# Altium schematic sheet 09) Expansion & Connect.SchDoc
size B; CompanyName: Microchip Technology Inc.; Organization: Microchip Technology; Address1: 2355 West Chandler Blvd.; Address2: Chandler, AZ  85224; Address4: USA; DocumentNumber: 9; SheetNumber: 9; SheetTotal: 9; SheetTitle: **; Time: Time
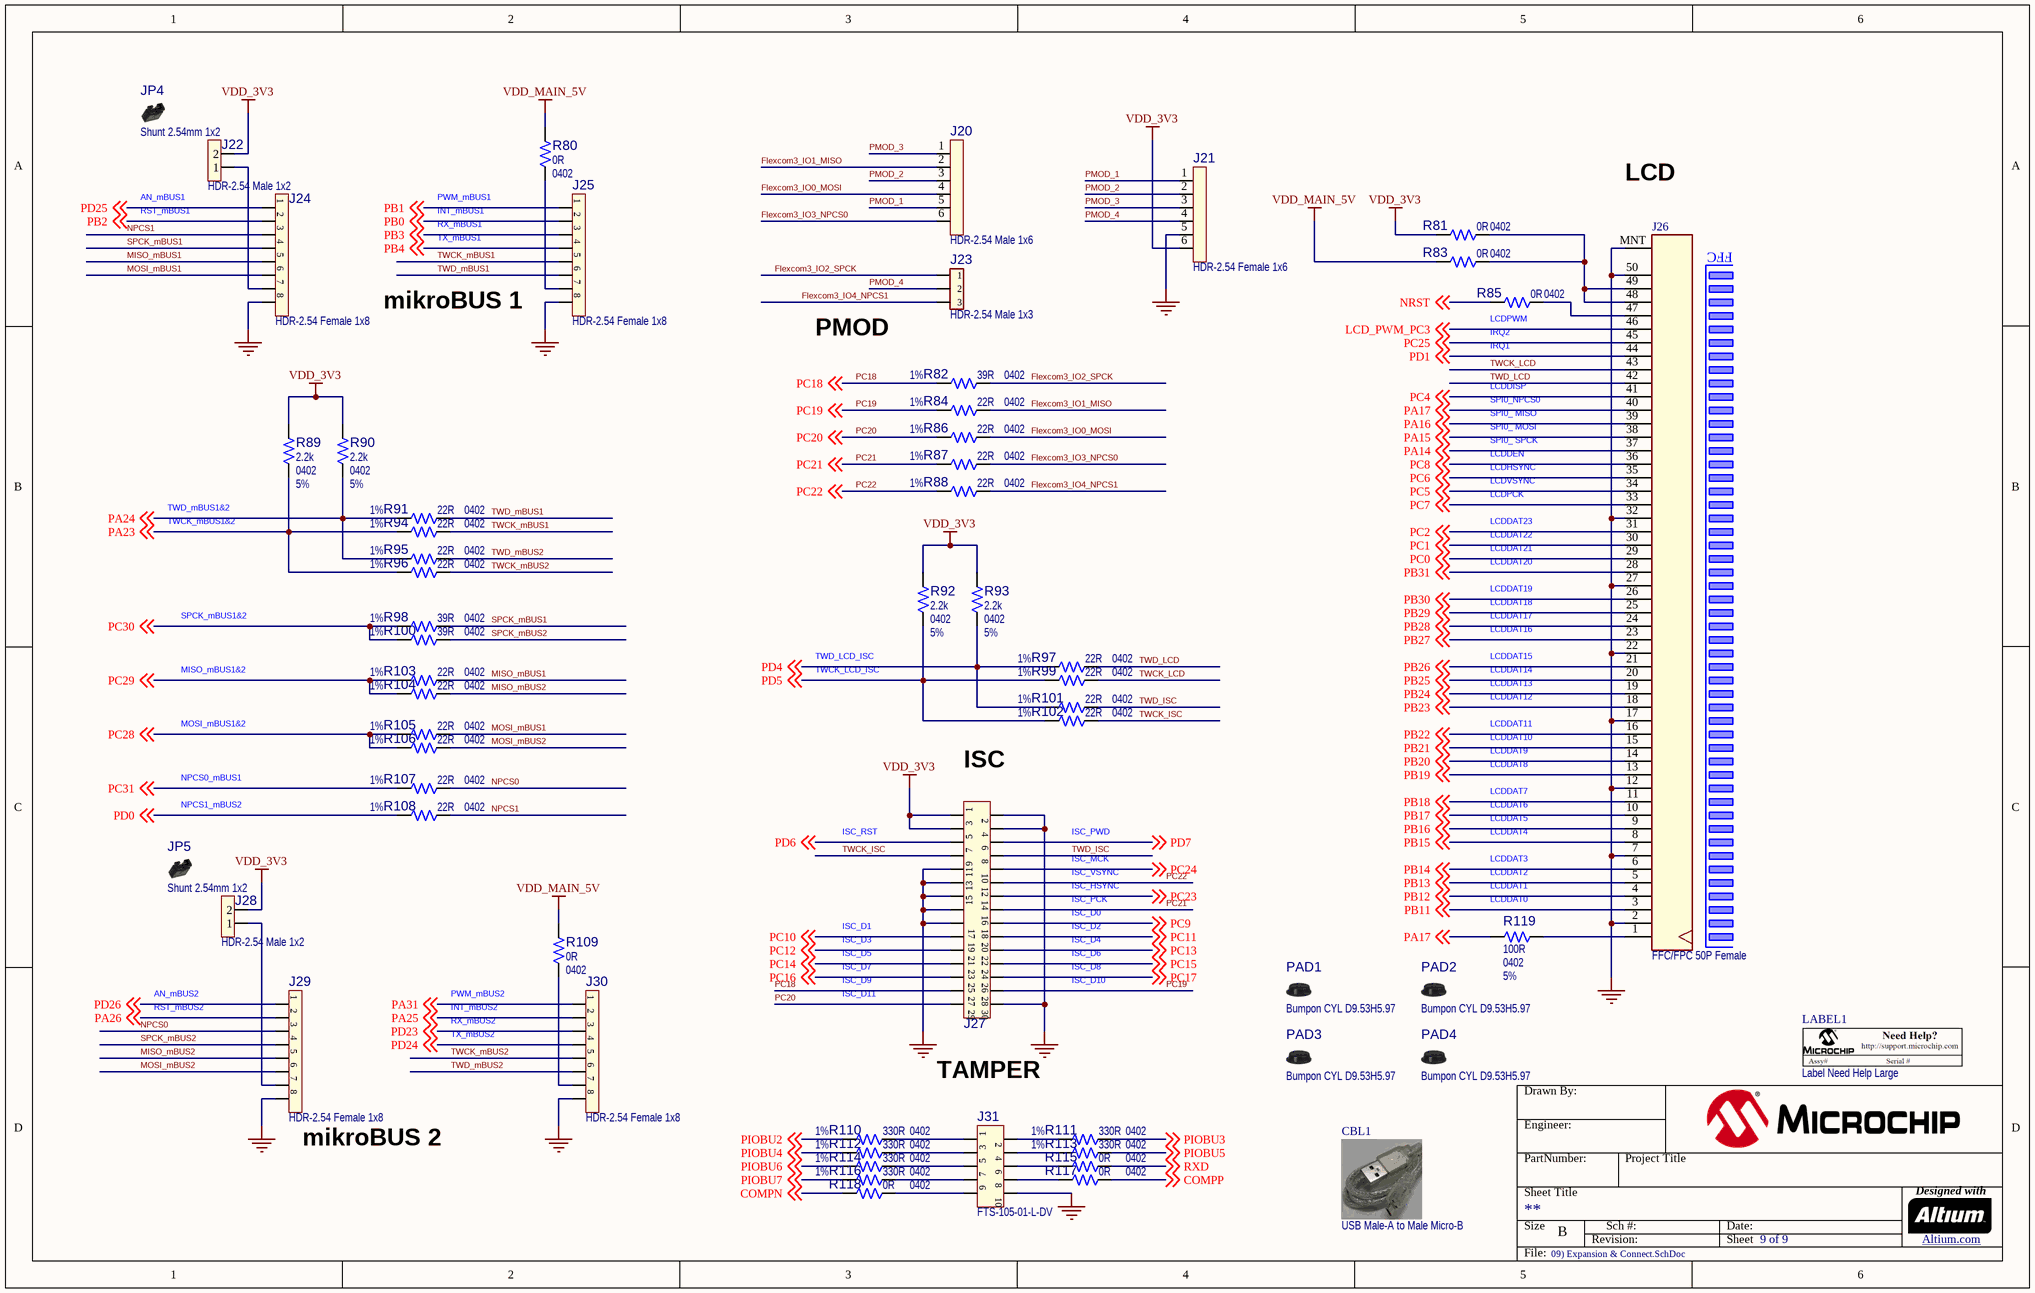
[diagram p0: 09) Expansion & Connect.SchDoc]

## Parts
?  (no value)  (graphical)
CBL1  value USB Male-A to Male Micro-B  (hidden comment: Cable USB A to Micro-B)  (mechanical)
J20  value HDR-2.54 Male 1x6  [HDR_M_2.54_1x6]  (hidden comment: Header 1x6)
J21  value HDR-2.54 Female 1x6  [HDR_F_2.54_1x6_RA]  (hidden comment: Header 1x6)
J22  value HDR-2.54 Male 1x2  [HDR_M_2.54_1x2]  (hidden comment: Header 1x2)
J23  value HDR-2.54 Male 1x3  [HDR_M_2.54_1x3]  (hidden comment: Header 1x3)
J24  value HDR-2.54 Female 1x8  [HDR_F_2.54_1X8]  (hidden comment: Header 1x8)
J25  value HDR-2.54 Female 1x8  [HDR_F_2.54_1X8]  (hidden comment: Header 1x8)
J26  value FFC/FPC 50P Female  [CON_FFC_0.5_FEMALE_1X50_SMD_OMR_XF2M-5015-1A]  (hidden comment: CON FFC 1x50 Mount)
J27  Header 2x15  [HDR_M_2.54_2x15]  (value not drawn)
J28  value HDR-2.54 Male 1x2  [HDR_M_2.54_1x2]  (hidden comment: Header 1x2)
J29  value HDR-2.54 Female 1x8  [HDR_F_2.54_1X8]  (hidden comment: Header 1x8)
J30  value HDR-2.54 Female 1x8  [HDR_F_2.54_1X8]  (hidden comment: Header 1x8)
J31  value FTS-105-01-L-DV  [HDR_M_1.27_2x5_SMD_V_SAM_FTS-105-01-L-DV]  (hidden comment: Header 2x5)
JP4  value Shunt 2.54mm 1x2  [Jumper_Mechanical]  (hidden comment: Jumper Mechanical)  (mechanical)
JP5  value Shunt 2.54mm 1x2  [Jumper_Mechanical]  (hidden comment: Jumper Mechanical)  (mechanical)
LABEL1  value Label Need Help Large  [LABEL_Need_Help_Large]  (hidden comment: LABEL_Need_Help_Large)
PAD1  value Bumpon CYL D9.53H5.97  [BUMP_3M_SJ61A2_CYLINDRICAL_BLACK_D9.53H5.97]  (hidden comment: Rubber Pad Cylindrical)
PAD2  value Bumpon CYL D9.53H5.97  [BUMP_3M_SJ61A2_CYLINDRICAL_BLACK_D9.53H5.97]  (hidden comment: Rubber Pad Cylindrical)
PAD3  value Bumpon CYL D9.53H5.97  [BUMP_3M_SJ61A2_CYLINDRICAL_BLACK_D9.53H5.97]  (hidden comment: Rubber Pad Cylindrical)
PAD4  value Bumpon CYL D9.53H5.97  [BUMP_3M_SJ61A2_CYLINDRICAL_BLACK_D9.53H5.97]  (hidden comment: Rubber Pad Cylindrical)
R80  value 0R  Package: 0402  [RES_C_0402]  (hidden comment: Resistor)
R81  value 0R  Package: 0402  [RES_C_0402]  (hidden comment: Resistor)
R82  value 39R  Package: 0402  Tolerance: 1%  [RES_C_0402]  (hidden comment: Resistor)
R83  value 0R  Package: 0402  [RES_C_0402]  (hidden comment: Resistor)
R84  value 22R  Package: 0402  Tolerance: 1%  [RES_C_0402]  (hidden comment: Resistor)
R85  value 0R  Package: 0402  [RES_C_0402]  (hidden comment: Resistor)
R86  value 22R  Package: 0402  Tolerance: 1%  [RES_C_0402]  (hidden comment: Resistor)
R87  value 22R  Package: 0402  Tolerance: 1%  [RES_C_0402]  (hidden comment: Resistor)
R88  value 22R  Package: 0402  Tolerance: 1%  [RES_C_0402]  (hidden comment: Resistor)
R89  value 2.2k  Package: 0402  Tolerance: 5%  [RES_C_0402]  (hidden comment: Resistor)
R90  value 2.2k  Package: 0402  Tolerance: 5%  [RES_C_0402]  (hidden comment: Resistor)
R91  value 22R  Package: 0402  Tolerance: 1%  [RES_C_0402]  (hidden comment: Resistor)
R92  value 2.2k  Package: 0402  Tolerance: 5%  [RES_C_0402]  (hidden comment: Resistor)
R93  value 2.2k  Package: 0402  Tolerance: 5%  [RES_C_0402]  (hidden comment: Resistor)
R94  value 22R  Package: 0402  Tolerance: 1%  [RES_C_0402]  (hidden comment: Resistor)
R95  value 22R  Package: 0402  Tolerance: 1%  [RES_C_0402]  (hidden comment: Resistor)
R96  value 22R  Package: 0402  Tolerance: 1%  [RES_C_0402]  (hidden comment: Resistor)
R97  value 22R  Package: 0402  Tolerance: 1%  [RES_C_0402]  (hidden comment: Resistor)
R98  value 39R  Package: 0402  Tolerance: 1%  [RES_C_0402]  (hidden comment: Resistor)
R99  value 22R  Package: 0402  Tolerance: 1%  [RES_C_0402]  (hidden comment: Resistor)
R100  value 39R  Package: 0402  Tolerance: 1%  [RES_C_0402]  (hidden comment: Resistor)
R101  value 22R  Package: 0402  Tolerance: 1%  [RES_C_0402]  (hidden comment: Resistor)
R102  value 22R  Package: 0402  Tolerance: 1%  [RES_C_0402]  (hidden comment: Resistor)
R103  value 22R  Package: 0402  Tolerance: 1%  [RES_C_0402]  (hidden comment: Resistor)
R104  value 22R  Package: 0402  Tolerance: 1%  [RES_C_0402]  (hidden comment: Resistor)
R105  value 22R  Package: 0402  Tolerance: 1%  [RES_C_0402]  (hidden comment: Resistor)
R106  value 22R  Package: 0402  Tolerance: 1%  [RES_C_0402]  (hidden comment: Resistor)
R107  value 22R  Package: 0402  Tolerance: 1%  [RES_C_0402]  (hidden comment: Resistor)
R108  value 22R  Package: 0402  Tolerance: 1%  [RES_C_0402]  (hidden comment: Resistor)
R109  value 0R  Package: 0402  [RES_C_0402]  (hidden comment: Resistor)
R110  value 330R  Package: 0402  Tolerance: 1%  [RES_C_0402]  (hidden comment: Resistor)
R111  value 330R  Package: 0402  Tolerance: 1%  [RES_C_0402]  (hidden comment: Resistor)
R112  value 330R  Package: 0402  Tolerance: 1%  [RES_C_0402]  (hidden comment: Resistor)
R113  value 330R  Package: 0402  Tolerance: 1%  [RES_C_0402]  (hidden comment: Resistor)
R114  value 330R  Package: 0402  Tolerance: 1%  [RES_C_0402]  (hidden comment: Resistor)
R115  value 0R  Package: 0402  [RES_C_0402]  (hidden comment: Resistor)
R116  value 330R  Package: 0402  Tolerance: 1%  [RES_C_0402]  (hidden comment: Resistor)
R117  value 0R  Package: 0402  [RES_C_0402]  (hidden comment: Resistor)
R118  value 0R  Package: 0402  [RES_C_0402]  (hidden comment: Resistor)
R119  value 100R  Package: 0402  Tolerance: 5%  [RES_C_0402]  (hidden comment: Resistor)

## Nets
GND_POWER: J21.5 J24.8 J25.8 J26.2 J26.7 J26.12 J26.17 J26.22 J26.27 J26.32 J26.50 J26.MNT J27.2 J27.4 J27.9 J27.11 J27.13 J27.15 J27.17 J27.30 J29.8 J30.8 J31.10
VDD_3V3: J21.6 J22.2 J27.1 J27.3 J28.2 R81.1 R89.1 R90.1 R92.1 R93.1
VDD_MAIN_5V: R80.2 R83.1 R109.2
COMPN: R118.1 ; off-sheet COMPN
COMPP: R117.2 ; off-sheet COMPP
Flexcom3_IO0_MOSI: J20.4 R86.2
Flexcom3_IO1_MISO: J20.2 R84.2
Flexcom3_IO2_SPCK: J23.1 R82.2
Flexcom3_IO3_NPCS0: J20.6 R87.2
Flexcom3_IO4_NPCS1: J23.3 R88.2
LCD_PWM_PC3: J26.46 ; off-sheet LCD_PWM_PC3
MISO_mBUS1: J24.5 R103.2
MISO_mBUS2: J29.5 R104.2
MOSI_mBUS1: J24.6 R105.2
MOSI_mBUS2: J29.6 R106.2
NPCS0: J29.3 R107.2
NPCS1: J24.3 R108.2
NRST: R85.1 ; off-sheet NRST
PA14: J26.37 ; off-sheet PA14
PA15: J26.38 ; off-sheet PA15
PA16: J26.39 ; off-sheet PA16
PA17: J26.40 R119.1 ; off-sheet PA17
PA23: R89.2 R94.1 R96.1 ; off-sheet PA23
PA24: R90.2 R91.1 R95.1 ; off-sheet PA24
PA25: J30.2 ; off-sheet PA25
PA26: J29.2 ; off-sheet PA26
PA31: J30.1 ; off-sheet PA31
PB0: J25.2 ; off-sheet PB0
PB1: J25.1 ; off-sheet PB1
PB2: J24.2 ; off-sheet PB2
PB3: J25.3 ; off-sheet PB3
PB4: J25.4 ; off-sheet PB4
PB11: J26.3 ; off-sheet PB11
PB12: J26.4 ; off-sheet PB12
PB13: J26.5 ; off-sheet PB13
PB14: J26.6 ; off-sheet PB14
PB15: J26.8 ; off-sheet PB15
PB16: J26.9 ; off-sheet PB16
PB17: J26.10 ; off-sheet PB17
PB18: J26.11 ; off-sheet PB18
PB19: J26.13 ; off-sheet PB19
PB20: J26.14 ; off-sheet PB20
PB21: J26.15 ; off-sheet PB21
PB22: J26.16 ; off-sheet PB22
PB23: J26.18 ; off-sheet PB23
PB24: J26.19 ; off-sheet PB24
PB25: J26.20 ; off-sheet PB25
PB26: J26.21 ; off-sheet PB26
PB27: J26.23 ; off-sheet PB27
PB28: J26.24 ; off-sheet PB28
PB29: J26.25 ; off-sheet PB29
PB30: J26.26 ; off-sheet PB30
PB31: J26.28 ; off-sheet PB31
PC0: J26.29 ; off-sheet PC0
PC1: J26.30 ; off-sheet PC1
PC2: J26.31 ; off-sheet PC2
PC4: J26.41 ; off-sheet PC4
PC5: J26.34 ; off-sheet PC5
PC6: J26.35 ; off-sheet PC6
PC7: J26.33 ; off-sheet PC7
PC8: J26.36 ; off-sheet PC8
PC9: J27.18 ; off-sheet PC9
PC10: J27.19 ; off-sheet PC10
PC11: J27.20 ; off-sheet PC11
PC12: J27.21 ; off-sheet PC12
PC13: J27.22 ; off-sheet PC13
PC14: J27.23 ; off-sheet PC14
PC15: J27.24 ; off-sheet PC15
PC16: J27.25 ; off-sheet PC16
PC17: J27.26 ; off-sheet PC17
PC18: J27.27 R82.1 ; off-sheet PC18
PC19: J27.28 R84.1 ; off-sheet PC19
PC20: J27.29 R86.1 ; off-sheet PC20
PC21: J27.16 R87.1 ; off-sheet PC21
PC22: J27.12 R88.1 ; off-sheet PC22
PC23: J27.14 ; off-sheet PC23
PC24: J27.10 ; off-sheet PC24
PC25: J26.45 ; off-sheet PC25
PC28: R105.1 R106.1 ; off-sheet PC28
PC29: R103.1 R104.1 ; off-sheet PC29
PC30: R98.1 R100.1 ; off-sheet PC30
PC31: R107.1 ; off-sheet PC31
PD0: R108.1 ; off-sheet PD0
PD1: J26.44 ; off-sheet PD1
PD4: R93.2 R97.1 R101.1 ; off-sheet PD4
PD5: R92.2 R99.1 R102.1 ; off-sheet PD5
PD6: J27.5 ; off-sheet PD6
PD7: J27.6 ; off-sheet PD7
PD23: J30.3 ; off-sheet PD23
PD24: J30.4 ; off-sheet PD24
PD25: J24.1 ; off-sheet PD25
PD26: J29.1 ; off-sheet PD26
PIOBU2: R110.1 ; off-sheet PIOBU2
PIOBU3: R111.2 ; off-sheet PIOBU3
PIOBU4: R112.1 ; off-sheet PIOBU4
PIOBU5: R113.2 ; off-sheet PIOBU5
PIOBU6: R114.1 ; off-sheet PIOBU6
PIOBU7: R116.1 ; off-sheet PIOBU7
PMOD_1: J20.5 J21.1
PMOD_2: J20.3 J21.2
PMOD_3: J20.1 J21.3
PMOD_4: J21.4 J23.2
RXD: R115.2 ; off-sheet RXD
SPCK_mBUS1: J24.4 R98.2
SPCK_mBUS2: J29.4 R100.2
TWCK_ISC: J27.7 R102.2
TWCK_LCD: J26.43 R99.2
TWCK_mBUS1: J25.5 R94.2
TWCK_mBUS2: J30.5 R96.2
TWD_ISC: J27.8 R101.2
TWD_LCD: J26.42 R97.2
TWD_mBUS1: J25.6 R91.2
TWD_mBUS2: J30.6 R95.2
NetJ22_1: J22.1 J24.7
NetJ25_7: J25.7 R80.1
NetJ26_1: J26.1 R119.2
NetJ26_47: J26.47 R85.2
NetJ26_48: J26.48 J26.49 R81.2 R83.2
NetJ28_1: J28.1 J29.7
NetJ30_7: J30.7 R109.1
NetJ31_1: J31.1 R110.2
NetJ31_2: J31.2 R111.1
NetJ31_3: J31.3 R112.2
NetJ31_4: J31.4 R113.1
NetJ31_5: J31.5 R114.2
NetJ31_6: J31.6 R115.1
NetJ31_7: J31.7 R116.2
NetJ31_8: J31.8 R117.1
NetJ31_9: J31.9 R118.2

## Notes on the sheet
- RST_mBUS1
- AN_mBUS1
- RX_mBUS1
- INT_mBUS1
- PWM_mBUS1
- LCD
- TX_mBUS1
- mikroBUS 1
- PMOD
- (near R85) IRQ1
- (near R85) IRQ2
- (near R85) LCDPWM
- SPI0_ MOSI
- SPI0_ MISO
- SPI0_NPCS0
- LCDDISP
- SPI0_ SPCK
- LCDDEN
- LCDHSYNC
- LCDVSYNC
- LCDPCK
- TWD_mBUS1&2
- TWCK_mBUS1&2
- LCDDAT22
- LCDDAT21
- LCDDAT20
- LCDDAT23
- SPCK_mBUS1&2
- LCDDAT16
- LCDDAT19
- LCDDAT18
- LCDDAT17
- MISO_mBUS1&2
- TWD_LCD_ISC
- TWCK_LCD_ISC
- LCDDAT15
- LCDDAT14
- LCDDAT13
- LCDDAT12
- MOSI_mBUS1&2
- ISC
- LCDDAT11
- LCDDAT10
- LCDDAT9
- LCDDAT8
- NPCS0_mBUS1
- (near JP5) NPCS1_mBUS2
- ISC_RST
- ISC_PWD
- LCDDAT6
- LCDDAT5
- LCDDAT4
- LCDDAT7
- ISC_PCK
- ISC_HSYNC
- ISC_VSYNC
- ISC_MCK
- (near R119) LCDDAT0
- LCDDAT3
- LCDDAT2
- (near R119) LCDDAT1
- ISC_D7
- ISC_D5
- ISC_D3
- ISC_D1
- ISC_D8
- ISC_D6
- ISC_D4
- ISC_D2
- ISC_D0
- RST_mBUS2
- AN_mBUS2
- TX_mBUS2
- RX_mBUS2
- INT_mBUS2
- PWM_mBUS2
- ISC_D11
- ISC_D9
- ISC_D10
- TAMPER
- (near J29) mikroBUS 2
- Drawn By:
- Engineer:
- PartNumber:
- Project Title
- Sheet Title
- Size
- B
- Revision:
- Sch #:
- Date:
- Sheet
- Designed with
- Altium.com <http://go.altium.com/MicrochipLandingPage_Evaluation.html>
- File:
- (in symbol CON1372) FFC

## Library data of the parts
? = Title Block B
CBL1 = CAB0028: Manufacturer 1: DongGuan ZhanXin; Manufacturer Part Number 1: A006ZX027; Description_: MECH HW CABLE USB Male-A to Male Micro-B Clear 4'; Dev Tools Status: Production; Populated: MECH; MCHP-ID: CAB0028; Revision: 1; Symbol: Cable USB A to Micro-B; Status: MCL Design; ComponentLink1Description: SVN Datasheet; ComponentLink2Description: Local Datasheet; ComponentLink3URL: C:\ALTIUM_WORK\00001_MCHP-CDB\Library\LibraryRefs\Cable USB A to Micro-B.SchLib; ComponentLink3Description: Open Symbol; ComponentLink4Description: Open Footprint; ComponentLink5Description: Open Footprint 2; ComponentLink6Description: Open Footprint 3; ComponentLink7Description: Open Footprint 4; Type: Cable; Category: Hardware; Manufacturer 2: DongGuan ZanXin; Manufacturer Part Number 2: A006ZX021; Supplier 1: DongGuan ZhanXin; Supplier Part Number 1: A006ZX027; Supplier 2: Raynen; Supplier Part Number 2: CABL00191A01; Quantity Override: 1
J20 = CON1106: Manufacturer 1: FCI; Manufacturer Part Number 1: 68001-106HLF; Description_: CON HDR-2.54 Male 1x6 Gold 5.84MH TH VERT; Dev Tools Status: Production; Owner: Bogdan P (M91398); Populated: Yes; MCHP-ID: CON1106; Revision: 0; Symbol: Header 1x6; Status: MCL Design; ComponentLink1URL: https://chn-vm-apps.microchip.com/mchprepo/parts/Datasheets/68000.pdf; ComponentLink1Description: SVN Datasheet; ComponentLink2URL: C:\ALTIUM_WORK\00001_MCHP-CDB\Datasheets\68000.pdf; ComponentLink2Description: Local Datasheet; ComponentLink3URL: C:\ALTIUM_WORK\00001_MCHP-CDB\Library\LibraryRefs\Header 1x6.SchLib; ComponentLink3Description: Open Symbol; ComponentLink4URL: C:\ALTIUM_WORK\00001_MCHP-CDB\Library\Footprints\HDR_M_2.54_1x6.PcbLib; ComponentLink4Description: Open Footprint; ComponentLink5Description: Open Footprint 2; ComponentLink6Description: Open Footprint 3; ComponentLink7Description: Open Footprint 4; Type: Header 2.54mm; Category: Connector; Manufacturer 2: FCI; Manufacturer Part Number 2: 68000-106HLF; Manufacturer 3: Samtec Inc; Manufacturer Part Number 3: TSW-106-07-G-S; Supplier 1: Digi-Key; Supplier Part Number 1: 609-3272-ND; Supplier 2: Digi-Key; Supplier Part Number 2: 609-3249-ND; Supplier 3: Digi-Key; Supplier Part Number 3: SAM1029-06-ND; Quantity Override: 1
J21 = CON0170: Manufacturer 1: Sullins; Manufacturer Part Number 1: PPPC061LGBN-RC; Description_: CON HDR-2.54 Female 1x6 Gold TH R/A; Dev Tools Status: Production; Populated: Yes; MCHP-ID: CON0170; Revision: 3; Symbol: Header 1x6; Status: MCL Design; ComponentLink1URL: https://chn-vm-apps.microchip.com/mchprepo/parts/Datasheets/SSW-1XX-22-XXX-X-XX-XX-X-XX-MKT.pdf; ComponentLink1Description: SVN Datasheet; ComponentLink2URL: C:\ALTIUM_WORK\00001_MCHP-CDB\Datasheets\SSW-1XX-22-XXX-X-XX-XX-X-XX-MKT.pdf; ComponentLink2Description: Local Datasheet; ComponentLink3URL: C:\ALTIUM_WORK\00001_MCHP-CDB\Library\LibraryRefs\Header 1x6.SchLib; ComponentLink3Description: Open Symbol; ComponentLink4URL: C:\ALTIUM_WORK\00001_MCHP-CDB\Library\Footprints\HDR_F_2.54_1x6_RA.PcbLib; ComponentLink4Description: Open Footprint; ComponentLink5Description: Open Footprint 2; ComponentLink6Description: Open Footprint 3; ComponentLink7Description: Open Footprint 4; Type: Header 2.54mm; Category: Connector; Supplier 1: Digi-Key; Supplier Part Number 1: S5481-ND; Quantity Override: 1; Manufacturer 2: Mill-Max; Manufacturer Part Number 2: 801-43-006-20-001000; Manufacturer 3: Samtec; Manufacturer Part Number 3: SSW-106-02-F-S-RA; Supplier 2: Mill-Max; Supplier Part Number 2: 801-43-006-20-001000; Supplier 3: Samtec; Supplier Part Number 3: SSW-106-02-F-S-RA
J22 J28 = CON1108: Manufacturer 1: FCI; Manufacturer Part Number 1: 77311-118-02LF; Description_: CON HDR-2.54 Male 1x2 Gold 5.84MH TH VERT; Dev Tools Status: Production; Owner: Bogdan P (M91398); Populated: Yes; MCHP-ID: CON1108; Revision: 1; Symbol: Header 1x2; Status: MCL Design; ComponentLink1URL: https://chn-vm-apps.microchip.com/mchprepo/parts/Datasheets/77311.pdf; ComponentLink1Description: SVN Datasheet; ComponentLink2URL: C:\ALTIUM_WORK\00001_MCHP-CDB\Datasheets\77311.pdf; ComponentLink2Description: Local Datasheet; ComponentLink3URL: C:\ALTIUM_WORK\00001_MCHP-CDB\Library\LibraryRefs\Header 1x2.SchLib; ComponentLink3Description: Open Symbol; ComponentLink4URL: C:\ALTIUM_WORK\00001_MCHP-CDB\Library\Footprints\HDR_M_2.54_1x2.PcbLib; ComponentLink4Description: Open Footprint; ComponentLink5Description: Open Footprint 2; ComponentLink6Description: Open Footprint 3; ComponentLink7Description: Open Footprint 4; Type: Header 2.54mm; Category: Connector; Manufacturer 2: FCI; Manufacturer Part Number 2: 68001-202HLF; Manufacturer 3: FCI; Manufacturer Part Number 3: 68000-202HLF; Manufacturer 4: Samtec; Manufacturer Part Number 4: TSW-102-07-G-S; Manufacturer 5: Sullins; Manufacturer Part Number 5: PBC02SAAN; Manufacturer 6: SPC Technology; Manufacturer Part Number 6: SPC20481; Manufacturer 7: Samtec; Manufacturer Part Number 7: TSW-102-07-F-S; Manufacturer 8: Nextron; Manufacturer Part Number 8: R-211-0211-0021-000; Manufacturer 9: Samtec; Manufacturer Part Number 9: TSW-102-07-S-S; Supplier 1: Digi-Key; Supplier Part Number 1: 609-4434-ND; Supplier 2: Digi-Key; Supplier Part Number 2: 609-3469-ND; Supplier 3: Digi-Key; Supplier Part Number 3: 609-3502-ND; Supplier 4: Digi-Key; Supplier Part Number 4: SAM1029-02-ND; Supplier 5: Digi-Key; Supplier Part Number 5: S1011E-02-ND; Supplier 6: Newark; Supplier Part Number 6: 93K5734; Supplier 7: Newark; Supplier Part Number 7: 79P3146; Supplier 8: Raynen; Supplier Part Number 8: R-211-0211-0021-000; Supplier 9: Samtec; Supplier Part Number 9: TSW-102-07-S-S; Quantity Override: 1
J23 = CON1105: Manufacturer 1: FCI; Manufacturer Part Number 1: 68000-103HLF; Description_: CON HDR-2.54 Male 1x3 Gold 5.84MH TH VERT; Dev Tools Status: Production; Owner: Bogdan P (M91398); Populated: Yes; MCHP-ID: CON1105; Revision: 0; Symbol: Header 1x3; Status: MCL Design; ComponentLink1URL: https://chn-vm-apps.microchip.com/mchprepo/parts/Datasheets/68000.pdf; ComponentLink1Description: SVN Datasheet; ComponentLink2URL: C:\ALTIUM_WORK\00001_MCHP-CDB\Datasheets\68000.pdf; ComponentLink2Description: Local Datasheet; ComponentLink3URL: C:\ALTIUM_WORK\00001_MCHP-CDB\Library\LibraryRefs\Header 1x3.SchLib; ComponentLink3Description: Open Symbol; ComponentLink4URL: C:\ALTIUM_WORK\00001_MCHP-CDB\Library\Footprints\HDR_M_2.54_1x3.PcbLib; ComponentLink4Description: Open Footprint; ComponentLink5Description: Open Footprint 2; ComponentLink6Description: Open Footprint 3; ComponentLink7Description: Open Footprint 4; Type: Header 2.54mm; Category: Connector; Supplier 1: Digi-Key; Supplier Part Number 1: 609-3461-ND; Quantity Override: 1
J24 J25 J29 J30 = CON1363: CON HDR-2.54 Female 1x8 Gold TH; Manufacturer 1: Sullins Connector Solutions; Manufacturer Part Number 1: PPPC081LFBN-RC; Dev Tools Status: Production; Owner: Jamus Griego; Populated: YES; MCHP-ID: CON1363; Revision: 1; Symbol: Header 1x8; Description_: CON HDR-2.54 Female 1x8 Gold TH; Status: MCL Design; ComponentLink1URL: https://chn-vm-apps.microchip.com/mchprepo/parts/Datasheets/78_P(N)PxCxxxLFBN-RC,_10492-G.pdf; ComponentLink1Description: SVN Datasheet; ComponentLink2URL: C:\ALTIUM_WORK\00001_MCHP-CDB\Datasheets\78_P(N)PxCxxxLFBN-RC,_10492-G.pdf; ComponentLink2Description: Local Datasheet; ComponentLink3URL: C:\ALTIUM_WORK\00001_MCHP-CDB\Library\LibraryRefs\Header 1x8.SchLib; ComponentLink3Description: Open Symbol; ComponentLink4URL: C:\ALTIUM_WORK\00001_MCHP-CDB\Library\Footprints\HDR_F_2.54_1X8.PcbLib; ComponentLink4Description: Open Footprint; ComponentLink5Description: Open Footprint 2; ComponentLink6Description: Open Footprint 3; ComponentLink7Description: Open Footprint 4; Type: Header 2.54mm; Category: Connector; Supplier 1: Digi-Key; Supplier Part Number 1: S7041-ND; Quantity Override: 1
J26 = CON1372: Manufacturer 1: Omron Electronics Inc-EMC Div; Manufacturer Part Number 1: XF2M-5015-1A; Description_: CON FFC/FPC XF2M 0.5mm 50P Female SMD R/A; Dev Tools Status: Production; Owner: Tad Ahlvers; Current: 0.5A; Populated: YES; MCHP-ID: CON1372; Revision: 1; Symbol: CON FFC 1x50 Mount; Status: MCL Design; ComponentLink1URL: https://chn-vm-apps.microchip.com/mchprepo/parts/Datasheets/XF2M_0713.pdf; ComponentLink1Description: SVN Datasheet; ComponentLink2URL: C:\ALTIUM_WORK\00001_MCHP-CDB\Datasheets\XF2M_0713.pdf; ComponentLink2Description: Local Datasheet; ComponentLink3URL: C:\ALTIUM_WORK\00001_MCHP-CDB\Library\LibraryRefs\CON FFC 1x50 Mount.SchLib; ComponentLink3Description: Open Symbol; ComponentLink4URL: C:\ALTIUM_WORK\00001_MCHP-CDB\Library\Footprints\CON_FFC_0.5_FEMALE_1X50_SMD_OMR_XF2M-5015-1A.PcbLib; ComponentLink4Description: Open Footprint; ComponentLink5Description: Open Footprint 2; ComponentLink6Description: Open Footprint 3; ComponentLink7Description: Open Footprint 4; Type: FFC/FPC; Category: Connector; Supplier 1: Digi-Key; Supplier Part Number 1: OR732CT-ND; Quantity Override: 1
J27 = CON1580: Manufacturer 1: Wurth Electronics Inc.; Manufacturer Part Number 1: 61303021121; Description_: 30 Positions Header, Unshrouded, Breakaway Connector 0.100" (2.54mm) Through Hole Gold; Dev Tools Status: Production; Owner: Tim Moffat; Populated: YES; MCHP-ID: CON1580; Revision: 1; Symbol: Header 2x15; Status: MCL Design; ComponentLink1URL: https://chn-vm-apps.microchip.com/mchprepo/parts/Datasheets/ENG_CD_147062_L_147062_c.dwg.pdf; ComponentLink1Description: SVN Datasheet; ComponentLink2URL: C:\ALTIUM_WORK\00001_MCHP-CDB\Datasheets\ENG_CD_147062_L_147062_c.dwg.pdf; ComponentLink2Description: Local Datasheet; ComponentLink3URL: C:\ALTIUM_WORK\00001_MCHP-CDB\Library\LibraryRefs\Header 2x15.SchLib; ComponentLink3Description: Open Symbol; ComponentLink4URL: C:\ALTIUM_WORK\00001_MCHP-CDB\Library\Footprints\HDR_M_2.54_2x15.PcbLib; ComponentLink4Description: Open Footprint; ComponentLink5Description: Open Footprint 2; ComponentLink6Description: Open Footprint 3; ComponentLink7Description: Open Footprint 4; Type: Header 2.54mm; Category: Connector; Supplier 1: Digi-Key; Supplier Part Number 1: 732-5306-ND; Quantity Override: 1
J31 = CON1644: Manufacturer 1: Samtec Inc.; Manufacturer Part Number 1: FTS-105-01-L-DV-A; Description_: CON HDR-1.27 Male 2x5 SMD VERT; Dev Tools Status: Design; Owner: Dragos Danaila; Current: 3.3A; Populated: YES; MCHP-ID: CON1644; Revision: A; Symbol: Header 2x5; Status: MCL Design; ComponentLink1URL: https://chn-vm-apps.microchip.com/mchprepo/parts/Datasheets/fts.pdf; ComponentLink1Description: SVN Datasheet; ComponentLink2URL: C:\ALTIUM_WORK\00001_MCHP-CDB\Datasheets\fts.pdf; ComponentLink2Description: Local Datasheet; ComponentLink3URL: C:\ALTIUM_WORK\00001_MCHP-CDB\Library\LibraryRefs\Header 2x5.SchLib; ComponentLink3Description: Open Symbol; ComponentLink4URL: C:\ALTIUM_WORK\00001_MCHP-CDB\Library\Footprints\HDR_M_1.27_2x5_SMD_V_SAM_FTS-105-01-L-DV.PcbLib; ComponentLink4Description: Open Footprint; ComponentLink5Description: Open Footprint 2; ComponentLink6Description: Open Footprint 3; ComponentLink7Description: Open Footprint 4; Type: Header 1.27mm; Category: Connector; Voltage: -; Supplier 1: Digi-Key; Supplier Part Number 1: FTS-105-01-L-DV-A-ND; Quantity Override: 1
JP4 JP5 = HW1006: Manufacturer 1: 3M; Manufacturer Part Number 1: 969102-0000-DA; MCHP-ID: HW1006; Description_: MECH HW JUMPER 2.54mm 1x2; Dev Tools Status: Production; Owner: Mike Ragsdale; Populated: MECH; Revision: 1; Symbol: Jumper Mechanical; Status: MCL Design; ComponentLink1URL: https://chn-vm-apps.microchip.com/mchprepo/parts/Datasheets/63429.pdf; ComponentLink1Description: SVN Datasheet; ComponentLink2URL: C:\ALTIUM_WORK\00001_MCHP-CDB\Datasheets\63429.pdf; ComponentLink2Description: Local Datasheet; ComponentLink3URL: C:\ALTIUM_WORK\00001_MCHP-CDB\Library\LibraryRefs\Jumper Mechanical.SchLib; ComponentLink3Description: Open Symbol; ComponentLink4URL: C:\ALTIUM_WORK\00001_MCHP-CDB\Library\Footprints\Jumper_Mechanical.PcbLib; ComponentLink4Description: Open Footprint; ComponentLink5Description: Open Footprint 2; ComponentLink6Description: Open Footprint 3; ComponentLink7Description: Open Footprint 4; Type: Jumper; Category: Hardware; Manufacturer 2: FCI; Manufacturer Part Number 2: 63429-202LF; Manufacturer 3: Harwin; Manufacturer Part Number 3: M7567-05; Manufacturer 4: Sullins; Manufacturer Part Number 4: SSC02SYAN; Manufacturer 5: Tyco Electronics (TE Connectivity); Manufacturer Part Number 5: 382811-6; Manufacturer 6: Tyco Electronics (TE Connectivity); Manufacturer Part Number 6: 2-382811-1; Manufacturer 7: Samtec; Manufacturer Part Number 7: SNT-100-BK-G; Manufacturer 8: Sullins Connector Solutions; Manufacturer Part Number 8: STC02SYAN; Manufacturer 9: Sullins Connector Solutions; Manufacturer Part Number 9: SPC02SVGN-RC; Supplier 1: Digi-Key; Supplier Part Number 1: 3M9580-ND; Supplier 2: Digi-Key; Supplier Part Number 2: 609-2997-ND; Supplier 3: Digi-Key; Supplier Part Number 3: M7567-05-ND; Supplier 4: Digi-Key; Supplier Part Number 4: S9002-ND; Supplier 5: Digi-Key; Supplier Part Number 5: A26227-ND; Supplier 6: Digi-Key; Supplier Part Number 6: A31697-ND; Supplier 7: Samtec; Supplier Part Number 7: SNT-100-BK-G; Supplier 8: Digi-Key; Supplier Part Number 8: S9000-ND; Supplier 9: Digi-Key; Supplier Part Number 9: S9338-ND; Quantity Override: 1
LABEL1 = 08-00126: Description_: LABEL, NEED HELP WITH ASSY/SERIAL; Dev Tools Status: Production; Populated: MECH; MCHP-ID: 08-00126; Revision: 6; Symbol: LABEL_Need_Help_Large; Status: MCL Design; ComponentLink1URL: https://chn-vm-apps.microchip.com/mchprepo/parts/Datasheets/08-00126R6.pdf; ComponentLink1Description: SVN Datasheet; ComponentLink2URL: C:\ALTIUM_WORK\00001_MCHP-CDB\Datasheets\08-00126R6.pdf; ComponentLink2Description: Local Datasheet; ComponentLink3URL: C:\ALTIUM_WORK\00001_MCHP-CDB\Library\LibraryRefs\LABEL_Need_Help_Large.SchLib; ComponentLink3Description: Open Symbol; ComponentLink4URL: C:\ALTIUM_WORK\00001_MCHP-CDB\Library\Footprints\LABEL_Need_Help_Large.PcbLib; ComponentLink4Description: Open Footprint; ComponentLink5Description: Open Footprint 2; ComponentLink6Description: Open Footprint 3; ComponentLink7Description: Open Footprint 4; Type: Large; Category: Label; Quantity Override: 1
PAD1-PAD4 = MISC1052: Manufacturer 1: 3M                                                                               3M; Manufacturer Part Number 1: SJ61A2; Description_: MECH HW RUBBER PAD CYLINDRICAL D9.53H5.97; Dev Tools Status: Production; Owner: Mark Loper; Populated: MECH; MCHP-ID: MISC1052; Revision: 1; Symbol: RUBBER PAD CYLINDRICAL; Status: MCL Design; ComponentLink1URL: https://chn-vm-apps.microchip.com/mchprepo/parts/Datasheets/SJ61A2.pdf; ComponentLink1Description: SVN Datasheet; ComponentLink2URL: C:\ALTIUM_WORK\00001_MCHP-CDB\Datasheets\SJ61A2.pdf; ComponentLink2Description: Local Datasheet; ComponentLink3URL: C:\ALTIUM_WORK\00001_MCHP-CDB\Library\LibraryRefs\RUBBER PAD CYLINDRICAL.SchLib; ComponentLink3Description: Open Symbol; ComponentLink4URL: C:\ALTIUM_WORK\00001_MCHP-CDB\Library\Footprints\BUMP_3M_SJ61A2_CYLINDRICAL_BLACK_D9.53H5.97.PcbLib; ComponentLink4Description: Open Footprint; ComponentLink5Description: Open Footprint 2; ComponentLink6Description: Open Footprint 3; ComponentLink7Description: Open Footprint 4; Type: Rubber Pad; Category: Hardware; Supplier 1: Digi-Key; Supplier Part Number 1: SJ5748-0-ND; Quantity Override: 1
R80 R81 R109 = RSMT0730: Manufacturer 1: Panasonic; Manufacturer Part Number 1: ERJ-2GE0R00X; Description_: RES TKF 0R SMD 0402; Dev Tools Status: Production; Power: 1/10W; Populated: DNP; MCHP-ID: RSMT0730; Revision: 2; Symbol: Resistor; Status: MCL Design; ComponentLink1URL: https://chn-vm-apps.microchip.com/mchprepo/parts/Datasheets/AOA0000CE1.pdf; ComponentLink1Description: SVN Datasheet; ComponentLink2URL: C:\ALTIUM_WORK\00001_MCHP-CDB\Datasheets\AOA0000CE1.pdf; ComponentLink2Description: Local Datasheet; ComponentLink3URL: C:\ALTIUM_WORK\00001_MCHP-CDB\Library\LibraryRefs\Resistor.SchLib; ComponentLink3Description: Open Symbol; ComponentLink4URL: C:\ALTIUM_WORK\00001_MCHP-CDB\Library\Footprints\RES_C_0402.PcbLib; ComponentLink4Description: Open Footprint; ComponentLink5Description: Open Footprint 2; ComponentLink6Description: Open Footprint 3; ComponentLink7Description: Open Footprint 4; Operating Temperature: -55C to +155C; Category: Resistor; Type: RES SMD; Composition: TKF; Manufacturer 2: Vishay; Manufacturer Part Number 2: CRCW04020000Z0ED; Supplier 1: Digi-Key; Supplier Part Number 1: P0.0JCT-ND; Supplier 2: Digi-Key; Supplier Part Number 2: 541-0.0JTR-ND; Quantity Override: 1
R82 R98 R100 = RES1800: Manufacturer 1: Yageo; Manufacturer Part Number 1: RC0402FR-0739RL; Description_: RES TKF 39R 1% 1/16W SMD 0402; Dev Tools Status: Design; Circuit Type: Single; Power: 1/16W; Owner: Sompoch Loboonlert; Populated: YES; MCHP-ID: RES1800; Revision: B; Symbol: Resistor; Status: MCL Design; ComponentLink1URL: https://chn-vm-apps.microchip.com/mchprepo/parts/Datasheets/PYu-R_INT-thick_7.pdf; ComponentLink1Description: SVN Datasheet; ComponentLink2URL: C:\ALTIUM_WORK\00001_MCHP-CDB\Datasheets\PYu-R_INT-thick_7.pdf; ComponentLink2Description: Local Datasheet; ComponentLink3URL: C:\ALTIUM_WORK\00001_MCHP-CDB\Library\LibraryRefs\Resistor.SchLib; ComponentLink3Description: Open Symbol; ComponentLink4URL: C:\ALTIUM_WORK\00001_MCHP-CDB\Library\Footprints\RES_C_0402.PcbLib; ComponentLink4Description: Open Footprint; ComponentLink5Description: Open Footprint 2; ComponentLink6Description: Open Footprint 3; ComponentLink7Description: Open Footprint 4; Operating Temperature: -55°C ~ 155°C; Category: Resistor; Type: RES SMD; Composition: TKF; Manufacturer 2: Digi-Key; Manufacturer Part Number 2: 311-39.0LRCT-ND; Supplier 1: Yageo; Supplier Part Number 1: RC0402FR-0739RL; Supplier 2: Digi-Key; Supplier Part Number 2: 311-39.0LRCT-ND; Quantity Override: 1
R83 R85 R115 R117 R118 = RSMT0730: Manufacturer 1: Panasonic; Manufacturer Part Number 1: ERJ-2GE0R00X; Description_: RES TKF 0R SMD 0402; Dev Tools Status: Production; Power: 1/10W; Populated: Yes; MCHP-ID: RSMT0730; Revision: 2; Symbol: Resistor; Status: MCL Design; ComponentLink1URL: https://chn-vm-apps.microchip.com/mchprepo/parts/Datasheets/AOA0000CE1.pdf; ComponentLink1Description: SVN Datasheet; ComponentLink2URL: C:\ALTIUM_WORK\00001_MCHP-CDB\Datasheets\AOA0000CE1.pdf; ComponentLink2Description: Local Datasheet; ComponentLink3URL: C:\ALTIUM_WORK\00001_MCHP-CDB\Library\LibraryRefs\Resistor.SchLib; ComponentLink3Description: Open Symbol; ComponentLink4URL: C:\ALTIUM_WORK\00001_MCHP-CDB\Library\Footprints\RES_C_0402.PcbLib; ComponentLink4Description: Open Footprint; ComponentLink5Description: Open Footprint 2; ComponentLink6Description: Open Footprint 3; ComponentLink7Description: Open Footprint 4; Operating Temperature: -55C to +155C; Category: Resistor; Type: RES SMD; Composition: TKF; Manufacturer 2: Vishay; Manufacturer Part Number 2: CRCW04020000Z0ED; Supplier 1: Digi-Key; Supplier Part Number 1: P0.0JCT-ND; Supplier 2: Digi-Key; Supplier Part Number 2: 541-0.0JTR-ND; Quantity Override: 1
R84 R86-R88 R91 R94-R97 R99 R101-R108 = RES1474: Manufacturer 1: Panasonic Electronic Components; Manufacturer Part Number 1: ERJ-2RKF22R0X; Description_: RES TKF 22R 1% 1/20W SMD 0402; Dev Tools Status: Production; Temperature Coeffcient: 100ppm/C; Circuit Type: Isolated; Power: 1/10W; Owner: Mike Ragsdale; Populated: YES; MCHP-ID: RES1474; Revision: 1; Symbol: Resistor; Status: MCL Design; ComponentLink1Description: SVN Datasheet; ComponentLink2Description: Local Datasheet; ComponentLink3URL: C:\ALTIUM_WORK\00001_MCHP-CDB\Library\LibraryRefs\Resistor.SchLib; ComponentLink3Description: Open Symbol; ComponentLink4URL: C:\ALTIUM_WORK\00001_MCHP-CDB\Library\Footprints\RES_C_0402.PcbLib; ComponentLink4Description: Open Footprint; ComponentLink5Description: Open Footprint 2; ComponentLink6Description: Open Footprint 3; ComponentLink7Description: Open Footprint 4; Operating Temperature: -55C to +155C; Category: Resistor; Type: RES SMD; Composition: TKF; Supplier 1: Digi-Key; Supplier Part Number 1: P22.0LCT-ND; Quantity Override: 1
R89 R90 R92 R93 = RES1020: Manufacturer 1: Vishay Dale; Manufacturer Part Number 1: CRCW04022K20JNED; Description_: RES TKF 2.2k 5% 1/16W SMD 0402; Dev Tools Status: Production; Voltage: 50V; Temperature Coeffcient: 200ppm/C; Power: 1/16W; Owner: Tad Ahlvers; Populated: YES; MCHP-ID: RES1020; Revision: 1; Symbol: Resistor; Status: MCL Design; ComponentLink1URL: https://chn-vm-apps.microchip.com/mchprepo/parts/Datasheets/dcrcwe3.pdf; ComponentLink1Description: SVN Datasheet; ComponentLink2URL: C:\ALTIUM_WORK\00001_MCHP-CDB\Datasheets\dcrcwe3.pdf; ComponentLink2Description: Local Datasheet; ComponentLink3URL: C:\ALTIUM_WORK\00001_MCHP-CDB\Library\LibraryRefs\Resistor.SchLib; ComponentLink3Description: Open Symbol; ComponentLink4URL: C:\ALTIUM_WORK\00001_MCHP-CDB\Library\Footprints\RES_C_0402.PcbLib; ComponentLink4Description: Open Footprint; ComponentLink5Description: Open Footprint 2; ComponentLink6Description: Open Footprint 3; ComponentLink7Description: Open Footprint 4; Operating Temperature: -55C to +155C; Category: Resistor; Type: RES SMD; Composition: TKF; Supplier 1: Digi-Key; Supplier Part Number 1: 541-2.2KJCT-ND; Quantity Override: 1
R110-R114 R116 = RES1459: Manufacturer 1: KOA Speer; Manufacturer Part Number 1: RK73H1ETTP3300F; Description_: RES TKF 330R 1% 1/10W SMD 0402; Dev Tools Status: Production; Temperature Coeffcient: 100ppm/C; Circuit Type: Isolated; Power: 1/10W; Owner: Stephen Humberd; Populated: YES; MCHP-ID: RES1459; Revision: 1; Symbol: Resistor; Status: MCL Design; ComponentLink1URL: https://chn-vm-apps.microchip.com/mchprepo/parts/Datasheets/RK73H.pdf; ComponentLink1Description: SVN Datasheet; ComponentLink2URL: C:\ALTIUM_WORK\00001_MCHP-CDB\Datasheets\RK73H.pdf; ComponentLink2Description: Local Datasheet; ComponentLink3URL: C:\ALTIUM_WORK\00001_MCHP-CDB\Library\LibraryRefs\Resistor.SchLib; ComponentLink3Description: Open Symbol; ComponentLink4URL: C:\ALTIUM_WORK\00001_MCHP-CDB\Library\Footprints\RES_C_0402.PcbLib; ComponentLink4Description: Open Footprint; ComponentLink5Description: Open Footprint 2; ComponentLink6Description: Open Footprint 3; ComponentLink7Description: Open Footprint 4; Operating Temperature: -55C to +155C; Category: Resistor; Type: RES SMD; Composition: TF; Supplier 1: Mouser; Supplier Part Number 1: 660-RK73H1ETTP3300F; Quantity Override: 1
R119 = RSMT1038: Manufacturer 1: Yageo; Manufacturer Part Number 1: RC0402JR-07100RL; Description_: RES TKF 100R 5% 1/16W SMD 0402; Dev Tools Status: Production; Voltage: 50V; Temperature Coeffcient: 100ppm/C; Power: 1/16W; Owner: Sompoch Loboonlert; Populated: Yes; MCHP-ID: RSMT1038; Revision: 2; Symbol: Resistor; Status: MCL Design; ComponentLink1URL: https://chn-vm-apps.microchip.com/mchprepo/parts/Datasheets/PYu-RC0402_51_RoHS_L_6.pdf; ComponentLink1Description: SVN Datasheet; ComponentLink2URL: C:\ALTIUM_WORK\00001_MCHP-CDB\Datasheets\PYu-RC0402_51_RoHS_L_6.pdf; ComponentLink2Description: Local Datasheet; ComponentLink3URL: C:\ALTIUM_WORK\00001_MCHP-CDB\Library\LibraryRefs\Resistor.SchLib; ComponentLink3Description: Open Symbol; ComponentLink4URL: C:\ALTIUM_WORK\00001_MCHP-CDB\Library\Footprints\RES_C_0402.PcbLib; ComponentLink4Description: Open Footprint; ComponentLink5Description: Open Footprint 2; ComponentLink6Description: Open Footprint 3; ComponentLink7Description: Open Footprint 4; Operating Temperature: -55C to +155C; Category: Resistor; Type: RES SMD; Composition: TKF; Supplier 1: Digi-Key; Supplier Part Number 1: 311-100JRCT-ND; Quantity Override: 1